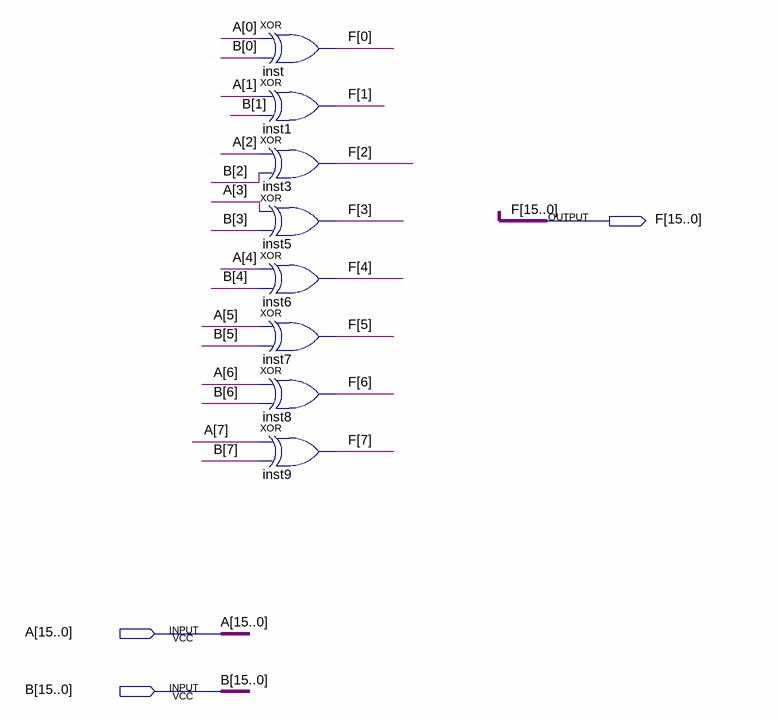
[diagram p0: schematic sheet]
// Quartus schematic 16BITXOR.bdf as structural Verilog: 8 symbols, 3 pins
module \16BITXOR  (
  input  [15:0] A,
  input  [15:0] B,
  output [15:0] F
);

  xor inst (F[0], A[0], B[0]);
  xor inst1 (F[1], A[1], B[1]);
  xor inst3 (F[2], A[2], B[2]);
  xor inst5 (F[3], A[3], B[3]);
  xor inst6 (F[4], A[4], B[4]);
  xor inst7 (F[5], A[5], B[5]);
  xor inst8 (F[6], A[6], B[6]);
  xor inst9 (F[7], A[7], B[7]);
endmodule
